# Altium project LedFlex.PrjPcb (part 2 of 4)

## Sheet LED_B.SchDoc
size B; SheetNumber: 1; SheetTotal: 3
Used 256 times, as channels LEDB1, LEDB2, LEDB3, LEDB4, LEDB5, LEDB6, LEDB7, LEDB8, LEDB9, LEDB10, LEDB11, LEDB12, LEDB13, LEDB14, LEDB15, LEDB16, LEDB17, LEDB18, LEDB19, LEDB20, LEDB21, LEDB22, LEDB23, LEDB24, LEDB25, LEDB26, LEDB27, LEDB28, LEDB29, LEDB30, LEDB31, LEDB32, LEDB33, LEDB34, LEDB35, LEDB36, LEDB37, LEDB38, LEDB39, LEDB40, LEDB41, LEDB42, LEDB43, LEDB44, LEDB45, LEDB46, LEDB47, LEDB48, LEDB49, LEDB50, LEDB51, LEDB52, LEDB53, LEDB54, LEDB55, LEDB56, LEDB57, LEDB58, LEDB59, LEDB60, LEDB61, LEDB62, LEDB63, LEDB64, LEDB65, LEDB66, LEDB67, LEDB68, LEDB69, LEDB70, LEDB71, LEDB72, LEDB73, LEDB74, LEDB75, LEDB76, LEDB77, LEDB78, LEDB79, LEDB80, LEDB81, LEDB82, LEDB83, LEDB84, LEDB85, LEDB86, LEDB87, LEDB88, LEDB89, LEDB90, LEDB91, LEDB92, LEDB93, LEDB94, LEDB95, LEDB96, LEDB97, LEDB98, LEDB99, LEDB100, LEDB101, LEDB102, LEDB103, LEDB104, LEDB105, LEDB106, LEDB107, LEDB108, LEDB109, LEDB110, LEDB111, LEDB112, LEDB113, LEDB114, LEDB115, LEDB116, LEDB117, LEDB118, LEDB119, LEDB120, LEDB121, LEDB122, LEDB123, LEDB124, LEDB125, LEDB126, LEDB127, LEDB128, LEDB129, LEDB130, LEDB131, LEDB132, LEDB133, LEDB134, LEDB135, LEDB136, LEDB137, LEDB138, LEDB139, LEDB140, LEDB141, LEDB142, LEDB143, LEDB144, LEDB145, LEDB146, LEDB147, LEDB148, LEDB149, LEDB150, LEDB151, LEDB152, LEDB153, LEDB154, LEDB155, LEDB156, LEDB157, LEDB158, LEDB159, LEDB160, LEDB161, LEDB162, LEDB163, LEDB164, LEDB165, LEDB166, LEDB167, LEDB168, LEDB169, LEDB170, LEDB171, LEDB172, LEDB173, LEDB174, LEDB175, LEDB176, LEDB177, LEDB178, LEDB179, LEDB180, LEDB181, LEDB182, LEDB183, LEDB184, LEDB185, LEDB186, LEDB187, LEDB188, LEDB189, LEDB190, LEDB191, LEDB192, LEDB193, LEDB194, LEDB195, LEDB196, LEDB197, LEDB198, LEDB199, LEDB200, LEDB201, LEDB202, LEDB203, LEDB204, LEDB205, LEDB206, LEDB207, LEDB208, LEDB209, LEDB210, LEDB211, LEDB212, LEDB213, LEDB214, LEDB215, LEDB216, LEDB217, LEDB218, LEDB219, LEDB220, LEDB221, LEDB222, LEDB223, LEDB224, LEDB225, LEDB226, LEDB227, LEDB228, LEDB229, LEDB230, LEDB231, LEDB232, LEDB233, LEDB234, LEDB235, LEDB236, LEDB237, LEDB238, LEDB239, LEDB240, LEDB241, LEDB242, LEDB243, LEDB244, LEDB245, LEDB246, LEDB247, LEDB248, LEDB249, LEDB250, LEDB251, LEDB252, LEDB253, LEDB254, LEDB255, LEDB256. Parts and nets are listed once, with the designators drawn on the sheet.
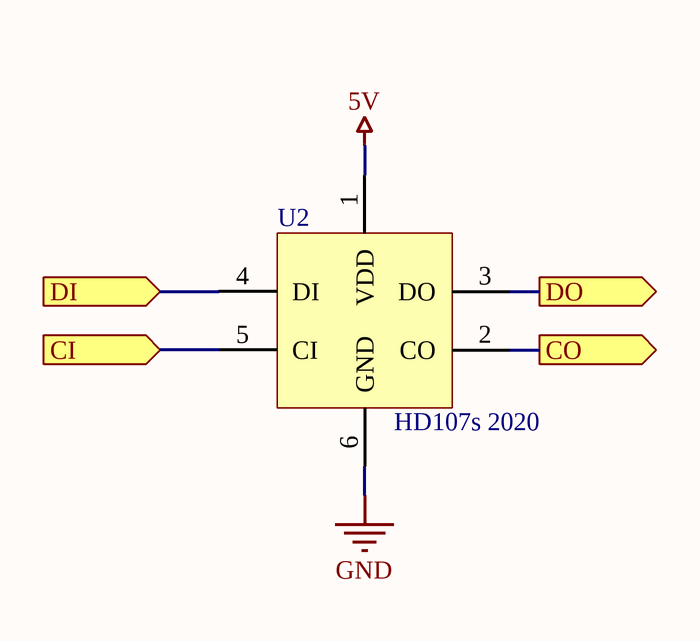
[diagram p2: LED_B.SchDoc]

### Parts
U2  HD107s 2020  [LED_HD107s-2020]

### Ports
CI (in), CO (out), DI (in), DO (out)

### Nets
5V: U2.1(VDD)
GND: U2.6(GND)
CI: U2.5(CI) ; port CI
CO: U2.2(CO) ; port CO
DI: U2.4(DI) ; port DI
DO: U2.3(DO) ; port DO

### Channels
LEDB1: designators end in _1; ports CI=B_CI1 CO=B_CI2 DI=B_DI1 DO=B_DI2
LEDB2: designators end in _2; ports CI=B_CI2 CO=B_CI3 DI=B_DI2 DO=B_DI3
LEDB3: designators end in _3; ports CI=B_CI3 CO=B_CI4 DI=B_DI3 DO=B_DI4
LEDB4: designators end in _4; ports CI=B_CI4 CO=B_CI5 DI=B_DI4 DO=B_DI5
LEDB5: designators end in _5; ports CI=B_CI5 CO=B_CI6 DI=B_DI5 DO=B_DI6
LEDB6: designators end in _6; ports CI=B_CI6 CO=B_CI7 DI=B_DI6 DO=B_DI7
LEDB7: designators end in _7; ports CI=B_CI7 CO=B_CI8 DI=B_DI7 DO=B_DI8
LEDB8: designators end in _8; ports CI=B_CI8 CO=B_CI9 DI=B_DI8 DO=B_DI9
LEDB9: designators end in _9; ports CI=B_CI9 CO=B_CI10 DI=B_DI9 DO=B_DI10
LEDB10: designators end in _10; ports CI=B_CI10 CO=B_CI11 DI=B_DI10 DO=B_DI11
LEDB11: designators end in _11; ports CI=B_CI11 CO=B_CI12 DI=B_DI11 DO=B_DI12
LEDB12: designators end in _12; ports CI=B_CI12 CO=B_CI13 DI=B_DI12 DO=B_DI13
LEDB13: designators end in _13; ports CI=B_CI13 CO=B_CI14 DI=B_DI13 DO=B_DI14
LEDB14: designators end in _14; ports CI=B_CI14 CO=B_CI15 DI=B_DI14 DO=B_DI15
LEDB15: designators end in _15; ports CI=B_CI15 CO=B_CI16 DI=B_DI15 DO=B_DI16
LEDB16: designators end in _16; ports CI=B_CI16 CO=B_CI17 DI=B_DI16 DO=B_DI17
LEDB17: designators end in _17; ports CI=B_CI17 CO=B_CI18 DI=B_DI17 DO=B_DI18
LEDB18: designators end in _18; ports CI=B_CI18 CO=B_CI19 DI=B_DI18 DO=B_DI19
LEDB19: designators end in _19; ports CI=B_CI19 CO=B_CI20 DI=B_DI19 DO=B_DI20
LEDB20: designators end in _20; ports CI=B_CI20 CO=B_CI21 DI=B_DI20 DO=B_DI21
LEDB21: designators end in _21; ports CI=B_CI21 CO=B_CI22 DI=B_DI21 DO=B_DI22
LEDB22: designators end in _22; ports CI=B_CI22 CO=B_CI23 DI=B_DI22 DO=B_DI23
LEDB23: designators end in _23; ports CI=B_CI23 CO=B_CI24 DI=B_DI23 DO=B_DI24
LEDB24: designators end in _24; ports CI=B_CI24 CO=B_CI25 DI=B_DI24 DO=B_DI25
LEDB25: designators end in _25; ports CI=B_CI25 CO=B_CI26 DI=B_DI25 DO=B_DI26
LEDB26: designators end in _26; ports CI=B_CI26 CO=B_CI27 DI=B_DI26 DO=B_DI27
LEDB27: designators end in _27; ports CI=B_CI27 CO=B_CI28 DI=B_DI27 DO=B_DI28
LEDB28: designators end in _28; ports CI=B_CI28 CO=B_CI29 DI=B_DI28 DO=B_DI29
LEDB29: designators end in _29; ports CI=B_CI29 CO=B_CI30 DI=B_DI29 DO=B_DI30
LEDB30: designators end in _30; ports CI=B_CI30 CO=B_CI31 DI=B_DI30 DO=B_DI31
LEDB31: designators end in _31; ports CI=B_CI31 CO=B_CI32 DI=B_DI31 DO=B_DI32
LEDB32: designators end in _32; ports CI=B_CI32 CO=B_CI33 DI=B_DI32 DO=B_DI33
LEDB33: designators end in _33; ports CI=B_CI33 CO=B_CI34 DI=B_DI33 DO=B_DI34
LEDB34: designators end in _34; ports CI=B_CI34 CO=B_CI35 DI=B_DI34 DO=B_DI35
LEDB35: designators end in _35; ports CI=B_CI35 CO=B_CI36 DI=B_DI35 DO=B_DI36
LEDB36: designators end in _36; ports CI=B_CI36 CO=B_CI37 DI=B_DI36 DO=B_DI37
LEDB37: designators end in _37; ports CI=B_CI37 CO=B_CI38 DI=B_DI37 DO=B_DI38
LEDB38: designators end in _38; ports CI=B_CI38 CO=B_CI39 DI=B_DI38 DO=B_DI39
LEDB39: designators end in _39; ports CI=B_CI39 CO=B_CI40 DI=B_DI39 DO=B_DI40
LEDB40: designators end in _40; ports CI=B_CI40 CO=B_CI41 DI=B_DI40 DO=B_DI41
LEDB41: designators end in _41; ports CI=B_CI41 CO=B_CI42 DI=B_DI41 DO=B_DI42
LEDB42: designators end in _42; ports CI=B_CI42 CO=B_CI43 DI=B_DI42 DO=B_DI43
LEDB43: designators end in _43; ports CI=B_CI43 CO=B_CI44 DI=B_DI43 DO=B_DI44
LEDB44: designators end in _44; ports CI=B_CI44 CO=B_CI45 DI=B_DI44 DO=B_DI45
LEDB45: designators end in _45; ports CI=B_CI45 CO=B_CI46 DI=B_DI45 DO=B_DI46
LEDB46: designators end in _46; ports CI=B_CI46 CO=B_CI47 DI=B_DI46 DO=B_DI47
LEDB47: designators end in _47; ports CI=B_CI47 CO=B_CI48 DI=B_DI47 DO=B_DI48
LEDB48: designators end in _48; ports CI=B_CI48 CO=B_CI49 DI=B_DI48 DO=B_DI49
LEDB49: designators end in _49; ports CI=B_CI49 CO=B_CI50 DI=B_DI49 DO=B_DI50
LEDB50: designators end in _50; ports CI=B_CI50 CO=B_CI51 DI=B_DI50 DO=B_DI51
LEDB51: designators end in _51; ports CI=B_CI51 CO=B_CI52 DI=B_DI51 DO=B_DI52
LEDB52: designators end in _52; ports CI=B_CI52 CO=B_CI53 DI=B_DI52 DO=B_DI53
LEDB53: designators end in _53; ports CI=B_CI53 CO=B_CI54 DI=B_DI53 DO=B_DI54
LEDB54: designators end in _54; ports CI=B_CI54 CO=B_CI55 DI=B_DI54 DO=B_DI55
LEDB55: designators end in _55; ports CI=B_CI55 CO=B_CI56 DI=B_DI55 DO=B_DI56
LEDB56: designators end in _56; ports CI=B_CI56 CO=B_CI57 DI=B_DI56 DO=B_DI57
LEDB57: designators end in _57; ports CI=B_CI57 CO=B_CI58 DI=B_DI57 DO=B_DI58
LEDB58: designators end in _58; ports CI=B_CI58 CO=B_CI59 DI=B_DI58 DO=B_DI59
LEDB59: designators end in _59; ports CI=B_CI59 CO=B_CI60 DI=B_DI59 DO=B_DI60
LEDB60: designators end in _60; ports CI=B_CI60 CO=B_CI61 DI=B_DI60 DO=B_DI61
LEDB61: designators end in _61; ports CI=B_CI61 CO=B_CI62 DI=B_DI61 DO=B_DI62
LEDB62: designators end in _62; ports CI=B_CI62 CO=B_CI63 DI=B_DI62 DO=B_DI63
LEDB63: designators end in _63; ports CI=B_CI63 CO=B_CI64 DI=B_DI63 DO=B_DI64
LEDB64: designators end in _64; ports CI=B_CI64 CO=B_CI65 DI=B_DI64 DO=B_DI65
LEDB65: designators end in _65; ports CI=B_CI65 CO=B_CI66 DI=B_DI65 DO=B_DI66
LEDB66: designators end in _66; ports CI=B_CI66 CO=B_CI67 DI=B_DI66 DO=B_DI67
LEDB67: designators end in _67; ports CI=B_CI67 CO=B_CI68 DI=B_DI67 DO=B_DI68
LEDB68: designators end in _68; ports CI=B_CI68 CO=B_CI69 DI=B_DI68 DO=B_DI69
LEDB69: designators end in _69; ports CI=B_CI69 CO=B_CI70 DI=B_DI69 DO=B_DI70
LEDB70: designators end in _70; ports CI=B_CI70 CO=B_CI71 DI=B_DI70 DO=B_DI71
LEDB71: designators end in _71; ports CI=B_CI71 CO=B_CI72 DI=B_DI71 DO=B_DI72
LEDB72: designators end in _72; ports CI=B_CI72 CO=B_CI73 DI=B_DI72 DO=B_DI73
LEDB73: designators end in _73; ports CI=B_CI73 CO=B_CI74 DI=B_DI73 DO=B_DI74
LEDB74: designators end in _74; ports CI=B_CI74 CO=B_CI75 DI=B_DI74 DO=B_DI75
LEDB75: designators end in _75; ports CI=B_CI75 CO=B_CI76 DI=B_DI75 DO=B_DI76
LEDB76: designators end in _76; ports CI=B_CI76 CO=B_CI77 DI=B_DI76 DO=B_DI77
LEDB77: designators end in _77; ports CI=B_CI77 CO=B_CI78 DI=B_DI77 DO=B_DI78
LEDB78: designators end in _78; ports CI=B_CI78 CO=B_CI79 DI=B_DI78 DO=B_DI79
LEDB79: designators end in _79; ports CI=B_CI79 CO=B_CI80 DI=B_DI79 DO=B_DI80
LEDB80: designators end in _80; ports CI=B_CI80 CO=B_CI81 DI=B_DI80 DO=B_DI81
LEDB81: designators end in _81; ports CI=B_CI81 CO=B_CI82 DI=B_DI81 DO=B_DI82
LEDB82: designators end in _82; ports CI=B_CI82 CO=B_CI83 DI=B_DI82 DO=B_DI83
LEDB83: designators end in _83; ports CI=B_CI83 CO=B_CI84 DI=B_DI83 DO=B_DI84
LEDB84: designators end in _84; ports CI=B_CI84 CO=B_CI85 DI=B_DI84 DO=B_DI85
LEDB85: designators end in _85; ports CI=B_CI85 CO=B_CI86 DI=B_DI85 DO=B_DI86
LEDB86: designators end in _86; ports CI=B_CI86 CO=B_CI87 DI=B_DI86 DO=B_DI87
LEDB87: designators end in _87; ports CI=B_CI87 CO=B_CI88 DI=B_DI87 DO=B_DI88
LEDB88: designators end in _88; ports CI=B_CI88 CO=B_CI89 DI=B_DI88 DO=B_DI89
LEDB89: designators end in _89; ports CI=B_CI89 CO=B_CI90 DI=B_DI89 DO=B_DI90
LEDB90: designators end in _90; ports CI=B_CI90 CO=B_CI91 DI=B_DI90 DO=B_DI91
LEDB91: designators end in _91; ports CI=B_CI91 CO=B_CI92 DI=B_DI91 DO=B_DI92
LEDB92: designators end in _92; ports CI=B_CI92 CO=B_CI93 DI=B_DI92 DO=B_DI93
LEDB93: designators end in _93; ports CI=B_CI93 CO=B_CI94 DI=B_DI93 DO=B_DI94
LEDB94: designators end in _94; ports CI=B_CI94 CO=B_CI95 DI=B_DI94 DO=B_DI95
LEDB95: designators end in _95; ports CI=B_CI95 CO=B_CI96 DI=B_DI95 DO=B_DI96
LEDB96: designators end in _96; ports CI=B_CI96 CO=B_CI97 DI=B_DI96 DO=B_DI97
LEDB97: designators end in _97; ports CI=B_CI97 CO=B_CI98 DI=B_DI97 DO=B_DI98
LEDB98: designators end in _98; ports CI=B_CI98 CO=B_CI99 DI=B_DI98 DO=B_DI99
LEDB99: designators end in _99; ports CI=B_CI99 CO=B_CI100 DI=B_DI99 DO=B_DI100
LEDB100: designators end in _100; ports CI=B_CI100 CO=B_CI101 DI=B_DI100 DO=B_DI101
LEDB101: designators end in _101; ports CI=B_CI101 CO=B_CI102 DI=B_DI101 DO=B_DI102
LEDB102: designators end in _102; ports CI=B_CI102 CO=B_CI103 DI=B_DI102 DO=B_DI103
LEDB103: designators end in _103; ports CI=B_CI103 CO=B_CI104 DI=B_DI103 DO=B_DI104
LEDB104: designators end in _104; ports CI=B_CI104 CO=B_CI105 DI=B_DI104 DO=B_DI105
LEDB105: designators end in _105; ports CI=B_CI105 CO=B_CI106 DI=B_DI105 DO=B_DI106
LEDB106: designators end in _106; ports CI=B_CI106 CO=B_CI107 DI=B_DI106 DO=B_DI107
LEDB107: designators end in _107; ports CI=B_CI107 CO=B_CI108 DI=B_DI107 DO=B_DI108
LEDB108: designators end in _108; ports CI=B_CI108 CO=B_CI109 DI=B_DI108 DO=B_DI109
LEDB109: designators end in _109; ports CI=B_CI109 CO=B_CI110 DI=B_DI109 DO=B_DI110
LEDB110: designators end in _110; ports CI=B_CI110 CO=B_CI111 DI=B_DI110 DO=B_DI111
LEDB111: designators end in _111; ports CI=B_CI111 CO=B_CI112 DI=B_DI111 DO=B_DI112
LEDB112: designators end in _112; ports CI=B_CI112 CO=B_CI113 DI=B_DI112 DO=B_DI113
LEDB113: designators end in _113; ports CI=B_CI113 CO=B_CI114 DI=B_DI113 DO=B_DI114
LEDB114: designators end in _114; ports CI=B_CI114 CO=B_CI115 DI=B_DI114 DO=B_DI115
LEDB115: designators end in _115; ports CI=B_CI115 CO=B_CI116 DI=B_DI115 DO=B_DI116
LEDB116: designators end in _116; ports CI=B_CI116 CO=B_CI117 DI=B_DI116 DO=B_DI117
LEDB117: designators end in _117; ports CI=B_CI117 CO=B_CI118 DI=B_DI117 DO=B_DI118
LEDB118: designators end in _118; ports CI=B_CI118 CO=B_CI119 DI=B_DI118 DO=B_DI119
LEDB119: designators end in _119; ports CI=B_CI119 CO=B_CI120 DI=B_DI119 DO=B_DI120
LEDB120: designators end in _120; ports CI=B_CI120 CO=B_CI121 DI=B_DI120 DO=B_DI121
LEDB121: designators end in _121; ports CI=B_CI121 CO=B_CI122 DI=B_DI121 DO=B_DI122
LEDB122: designators end in _122; ports CI=B_CI122 CO=B_CI123 DI=B_DI122 DO=B_DI123
LEDB123: designators end in _123; ports CI=B_CI123 CO=B_CI124 DI=B_DI123 DO=B_DI124
LEDB124: designators end in _124; ports CI=B_CI124 CO=B_CI125 DI=B_DI124 DO=B_DI125
LEDB125: designators end in _125; ports CI=B_CI125 CO=B_CI126 DI=B_DI125 DO=B_DI126
LEDB126: designators end in _126; ports CI=B_CI126 CO=B_CI127 DI=B_DI126 DO=B_DI127
LEDB127: designators end in _127; ports CI=B_CI127 CO=B_CI128 DI=B_DI127 DO=B_DI128
LEDB128: designators end in _128; ports CI=B_CI128 CO=B_CI129 DI=B_DI128 DO=B_DI129
LEDB129: designators end in _129; ports CI=B_CI129 CO=B_CI130 DI=B_DI129 DO=B_DI130
LEDB130: designators end in _130; ports CI=B_CI130 CO=B_CI131 DI=B_DI130 DO=B_DI131
LEDB131: designators end in _131; ports CI=B_CI131 CO=B_CI132 DI=B_DI131 DO=B_DI132
LEDB132: designators end in _132; ports CI=B_CI132 CO=B_CI133 DI=B_DI132 DO=B_DI133
LEDB133: designators end in _133; ports CI=B_CI133 CO=B_CI134 DI=B_DI133 DO=B_DI134
LEDB134: designators end in _134; ports CI=B_CI134 CO=B_CI135 DI=B_DI134 DO=B_DI135
LEDB135: designators end in _135; ports CI=B_CI135 CO=B_CI136 DI=B_DI135 DO=B_DI136
LEDB136: designators end in _136; ports CI=B_CI136 CO=B_CI137 DI=B_DI136 DO=B_DI137
LEDB137: designators end in _137; ports CI=B_CI137 CO=B_CI138 DI=B_DI137 DO=B_DI138
LEDB138: designators end in _138; ports CI=B_CI138 CO=B_CI139 DI=B_DI138 DO=B_DI139
LEDB139: designators end in _139; ports CI=B_CI139 CO=B_CI140 DI=B_DI139 DO=B_DI140
LEDB140: designators end in _140; ports CI=B_CI140 CO=B_CI141 DI=B_DI140 DO=B_DI141
LEDB141: designators end in _141; ports CI=B_CI141 CO=B_CI142 DI=B_DI141 DO=B_DI142
LEDB142: designators end in _142; ports CI=B_CI142 CO=B_CI143 DI=B_DI142 DO=B_DI143
LEDB143: designators end in _143; ports CI=B_CI143 CO=B_CI144 DI=B_DI143 DO=B_DI144
LEDB144: designators end in _144; ports CI=B_CI144 CO=B_CI145 DI=B_DI144 DO=B_DI145
LEDB145: designators end in _145; ports CI=B_CI145 CO=B_CI146 DI=B_DI145 DO=B_DI146
LEDB146: designators end in _146; ports CI=B_CI146 CO=B_CI147 DI=B_DI146 DO=B_DI147
LEDB147: designators end in _147; ports CI=B_CI147 CO=B_CI148 DI=B_DI147 DO=B_DI148
LEDB148: designators end in _148; ports CI=B_CI148 CO=B_CI149 DI=B_DI148 DO=B_DI149
LEDB149: designators end in _149; ports CI=B_CI149 CO=B_CI150 DI=B_DI149 DO=B_DI150
LEDB150: designators end in _150; ports CI=B_CI150 CO=B_CI151 DI=B_DI150 DO=B_DI151
LEDB151: designators end in _151; ports CI=B_CI151 CO=B_CI152 DI=B_DI151 DO=B_DI152
LEDB152: designators end in _152; ports CI=B_CI152 CO=B_CI153 DI=B_DI152 DO=B_DI153
LEDB153: designators end in _153; ports CI=B_CI153 CO=B_CI154 DI=B_DI153 DO=B_DI154
LEDB154: designators end in _154; ports CI=B_CI154 CO=B_CI155 DI=B_DI154 DO=B_DI155
LEDB155: designators end in _155; ports CI=B_CI155 CO=B_CI156 DI=B_DI155 DO=B_DI156
LEDB156: designators end in _156; ports CI=B_CI156 CO=B_CI157 DI=B_DI156 DO=B_DI157
LEDB157: designators end in _157; ports CI=B_CI157 CO=B_CI158 DI=B_DI157 DO=B_DI158
LEDB158: designators end in _158; ports CI=B_CI158 CO=B_CI159 DI=B_DI158 DO=B_DI159
LEDB159: designators end in _159; ports CI=B_CI159 CO=B_CI160 DI=B_DI159 DO=B_DI160
LEDB160: designators end in _160; ports CI=B_CI160 CO=B_CI161 DI=B_DI160 DO=B_DI161
LEDB161: designators end in _161; ports CI=B_CI161 CO=B_CI162 DI=B_DI161 DO=B_DI162
LEDB162: designators end in _162; ports CI=B_CI162 CO=B_CI163 DI=B_DI162 DO=B_DI163
LEDB163: designators end in _163; ports CI=B_CI163 CO=B_CI164 DI=B_DI163 DO=B_DI164
LEDB164: designators end in _164; ports CI=B_CI164 CO=B_CI165 DI=B_DI164 DO=B_DI165
LEDB165: designators end in _165; ports CI=B_CI165 CO=B_CI166 DI=B_DI165 DO=B_DI166
LEDB166: designators end in _166; ports CI=B_CI166 CO=B_CI167 DI=B_DI166 DO=B_DI167
LEDB167: designators end in _167; ports CI=B_CI167 CO=B_CI168 DI=B_DI167 DO=B_DI168
LEDB168: designators end in _168; ports CI=B_CI168 CO=B_CI169 DI=B_DI168 DO=B_DI169
LEDB169: designators end in _169; ports CI=B_CI169 CO=B_CI170 DI=B_DI169 DO=B_DI170
LEDB170: designators end in _170; ports CI=B_CI170 CO=B_CI171 DI=B_DI170 DO=B_DI171
LEDB171: designators end in _171; ports CI=B_CI171 CO=B_CI172 DI=B_DI171 DO=B_DI172
LEDB172: designators end in _172; ports CI=B_CI172 CO=B_CI173 DI=B_DI172 DO=B_DI173
LEDB173: designators end in _173; ports CI=B_CI173 CO=B_CI174 DI=B_DI173 DO=B_DI174
LEDB174: designators end in _174; ports CI=B_CI174 CO=B_CI175 DI=B_DI174 DO=B_DI175
LEDB175: designators end in _175; ports CI=B_CI175 CO=B_CI176 DI=B_DI175 DO=B_DI176
LEDB176: designators end in _176; ports CI=B_CI176 CO=B_CI177 DI=B_DI176 DO=B_DI177
LEDB177: designators end in _177; ports CI=B_CI177 CO=B_CI178 DI=B_DI177 DO=B_DI178
LEDB178: designators end in _178; ports CI=B_CI178 CO=B_CI179 DI=B_DI178 DO=B_DI179
LEDB179: designators end in _179; ports CI=B_CI179 CO=B_CI180 DI=B_DI179 DO=B_DI180
LEDB180: designators end in _180; ports CI=B_CI180 CO=B_CI181 DI=B_DI180 DO=B_DI181
LEDB181: designators end in _181; ports CI=B_CI181 CO=B_CI182 DI=B_DI181 DO=B_DI182
LEDB182: designators end in _182; ports CI=B_CI182 CO=B_CI183 DI=B_DI182 DO=B_DI183
LEDB183: designators end in _183; ports CI=B_CI183 CO=B_CI184 DI=B_DI183 DO=B_DI184
LEDB184: designators end in _184; ports CI=B_CI184 CO=B_CI185 DI=B_DI184 DO=B_DI185
LEDB185: designators end in _185; ports CI=B_CI185 CO=B_CI186 DI=B_DI185 DO=B_DI186
LEDB186: designators end in _186; ports CI=B_CI186 CO=B_CI187 DI=B_DI186 DO=B_DI187
LEDB187: designators end in _187; ports CI=B_CI187 CO=B_CI188 DI=B_DI187 DO=B_DI188
LEDB188: designators end in _188; ports CI=B_CI188 CO=B_CI189 DI=B_DI188 DO=B_DI189
LEDB189: designators end in _189; ports CI=B_CI189 CO=B_CI190 DI=B_DI189 DO=B_DI190
LEDB190: designators end in _190; ports CI=B_CI190 CO=B_CI191 DI=B_DI190 DO=B_DI191
LEDB191: designators end in _191; ports CI=B_CI191 CO=B_CI192 DI=B_DI191 DO=B_DI192
LEDB192: designators end in _192; ports CI=B_CI192 CO=B_CI193 DI=B_DI192 DO=B_DI193
LEDB193: designators end in _193; ports CI=B_CI193 CO=B_CI194 DI=B_DI193 DO=B_DI194
LEDB194: designators end in _194; ports CI=B_CI194 CO=B_CI195 DI=B_DI194 DO=B_DI195
LEDB195: designators end in _195; ports CI=B_CI195 CO=B_CI196 DI=B_DI195 DO=B_DI196
LEDB196: designators end in _196; ports CI=B_CI196 CO=B_CI197 DI=B_DI196 DO=B_DI197
LEDB197: designators end in _197; ports CI=B_CI197 CO=B_CI198 DI=B_DI197 DO=B_DI198
LEDB198: designators end in _198; ports CI=B_CI198 CO=B_CI199 DI=B_DI198 DO=B_DI199
LEDB199: designators end in _199; ports CI=B_CI199 CO=B_CI200 DI=B_DI199 DO=B_DI200
LEDB200: designators end in _200; ports CI=B_CI200 CO=B_CI201 DI=B_DI200 DO=B_DI201
LEDB201: designators end in _201; ports CI=B_CI201 CO=B_CI202 DI=B_DI201 DO=B_DI202
LEDB202: designators end in _202; ports CI=B_CI202 CO=B_CI203 DI=B_DI202 DO=B_DI203
LEDB203: designators end in _203; ports CI=B_CI203 CO=B_CI204 DI=B_DI203 DO=B_DI204
LEDB204: designators end in _204; ports CI=B_CI204 CO=B_CI205 DI=B_DI204 DO=B_DI205
LEDB205: designators end in _205; ports CI=B_CI205 CO=B_CI206 DI=B_DI205 DO=B_DI206
LEDB206: designators end in _206; ports CI=B_CI206 CO=B_CI207 DI=B_DI206 DO=B_DI207
LEDB207: designators end in _207; ports CI=B_CI207 CO=B_CI208 DI=B_DI207 DO=B_DI208
LEDB208: designators end in _208; ports CI=B_CI208 CO=B_CI209 DI=B_DI208 DO=B_DI209
LEDB209: designators end in _209; ports CI=B_CI209 CO=B_CI210 DI=B_DI209 DO=B_DI210
LEDB210: designators end in _210; ports CI=B_CI210 CO=B_CI211 DI=B_DI210 DO=B_DI211
LEDB211: designators end in _211; ports CI=B_CI211 CO=B_CI212 DI=B_DI211 DO=B_DI212
LEDB212: designators end in _212; ports CI=B_CI212 CO=B_CI213 DI=B_DI212 DO=B_DI213
LEDB213: designators end in _213; ports CI=B_CI213 CO=B_CI214 DI=B_DI213 DO=B_DI214
LEDB214: designators end in _214; ports CI=B_CI214 CO=B_CI215 DI=B_DI214 DO=B_DI215
LEDB215: designators end in _215; ports CI=B_CI215 CO=B_CI216 DI=B_DI215 DO=B_DI216
LEDB216: designators end in _216; ports CI=B_CI216 CO=B_CI217 DI=B_DI216 DO=B_DI217
LEDB217: designators end in _217; ports CI=B_CI217 CO=B_CI218 DI=B_DI217 DO=B_DI218
LEDB218: designators end in _218; ports CI=B_CI218 CO=B_CI219 DI=B_DI218 DO=B_DI219
LEDB219: designators end in _219; ports CI=B_CI219 CO=B_CI220 DI=B_DI219 DO=B_DI220
LEDB220: designators end in _220; ports CI=B_CI220 CO=B_CI221 DI=B_DI220 DO=B_DI221
LEDB221: designators end in _221; ports CI=B_CI221 CO=B_CI222 DI=B_DI221 DO=B_DI222
LEDB222: designators end in _222; ports CI=B_CI222 CO=B_CI223 DI=B_DI222 DO=B_DI223
LEDB223: designators end in _223; ports CI=B_CI223 CO=B_CI224 DI=B_DI223 DO=B_DI224
LEDB224: designators end in _224; ports CI=B_CI224 CO=B_CI225 DI=B_DI224 DO=B_DI225
LEDB225: designators end in _225; ports CI=B_CI225 CO=B_CI226 DI=B_DI225 DO=B_DI226
LEDB226: designators end in _226; ports CI=B_CI226 CO=B_CI227 DI=B_DI226 DO=B_DI227
LEDB227: designators end in _227; ports CI=B_CI227 CO=B_CI228 DI=B_DI227 DO=B_DI228
LEDB228: designators end in _228; ports CI=B_CI228 CO=B_CI229 DI=B_DI228 DO=B_DI229
LEDB229: designators end in _229; ports CI=B_CI229 CO=B_CI230 DI=B_DI229 DO=B_DI230
LEDB230: designators end in _230; ports CI=B_CI230 CO=B_CI231 DI=B_DI230 DO=B_DI231
LEDB231: designators end in _231; ports CI=B_CI231 CO=B_CI232 DI=B_DI231 DO=B_DI232
LEDB232: designators end in _232; ports CI=B_CI232 CO=B_CI233 DI=B_DI232 DO=B_DI233
LEDB233: designators end in _233; ports CI=B_CI233 CO=B_CI234 DI=B_DI233 DO=B_DI234
LEDB234: designators end in _234; ports CI=B_CI234 CO=B_CI235 DI=B_DI234 DO=B_DI235
LEDB235: designators end in _235; ports CI=B_CI235 CO=B_CI236 DI=B_DI235 DO=B_DI236
LEDB236: designators end in _236; ports CI=B_CI236 CO=B_CI237 DI=B_DI236 DO=B_DI237
LEDB237: designators end in _237; ports CI=B_CI237 CO=B_CI238 DI=B_DI237 DO=B_DI238
LEDB238: designators end in _238; ports CI=B_CI238 CO=B_CI239 DI=B_DI238 DO=B_DI239
LEDB239: designators end in _239; ports CI=B_CI239 CO=B_CI240 DI=B_DI239 DO=B_DI240
LEDB240: designators end in _240; ports CI=B_CI240 CO=B_CI241 DI=B_DI240 DO=B_DI241
LEDB241: designators end in _241; ports CI=B_CI241 CO=B_CI242 DI=B_DI241 DO=B_DI242
LEDB242: designators end in _242; ports CI=B_CI242 CO=B_CI243 DI=B_DI242 DO=B_DI243
LEDB243: designators end in _243; ports CI=B_CI243 CO=B_CI244 DI=B_DI243 DO=B_DI244
LEDB244: designators end in _244; ports CI=B_CI244 CO=B_CI245 DI=B_DI244 DO=B_DI245
LEDB245: designators end in _245; ports CI=B_CI245 CO=B_CI246 DI=B_DI245 DO=B_DI246
LEDB246: designators end in _246; ports CI=B_CI246 CO=B_CI247 DI=B_DI246 DO=B_DI247
LEDB247: designators end in _247; ports CI=B_CI247 CO=B_CI248 DI=B_DI247 DO=B_DI248
LEDB248: designators end in _248; ports CI=B_CI248 CO=B_CI249 DI=B_DI248 DO=B_DI249
LEDB249: designators end in _249; ports CI=B_CI249 CO=B_CI250 DI=B_DI249 DO=B_DI250
LEDB250: designators end in _250; ports CI=B_CI250 CO=B_CI251 DI=B_DI250 DO=B_DI251
LEDB251: designators end in _251; ports CI=B_CI251 CO=B_CI252 DI=B_DI251 DO=B_DI252
LEDB252: designators end in _252; ports CI=B_CI252 CO=B_CI253 DI=B_DI252 DO=B_DI253
LEDB253: designators end in _253; ports CI=B_CI253 CO=B_CI254 DI=B_DI253 DO=B_DI254
LEDB254: designators end in _254; ports CI=B_CI254 CO=B_CI255 DI=B_DI254 DO=B_DI255
LEDB255: designators end in _255; ports CI=B_CI255 CO=B_CI256 DI=B_DI255 DO=B_DI256
LEDB256: designators end in _256; ports CI=B_CI256 CO=B_CI257 DI=B_DI256 DO=B_DI257

### Library data of the parts
U2 = HD107s-2020: 8-pin type LED three-color RGB Dimming control; MP: APA-102-2020-256-8; MF: iPixel LED Light Co.; Value: *; SnapEDA_Link: https://www.snapeda.com/parts/APA-102-2020-256-8/iPixel%20LED%20Light%20Co./view-part/698331/?ref=snap; Availability: Unavailable; Package: SMD-8 iPixel LED Light Co.; Price: None